# Altium schematic sheet Source_TIA.SchDoc: TIA and damper
size A4; Author: Watzek; DrawnBy: Watzek; Organization: HTL Hollabrunn; Address1: Abteilung Elektronik; Address2: Anton Ehrenfried-Straße 10; Address3: 2020 Hollabrunn; DocumentNumber: 02; Revision: 02; SheetNumber: 02; SheetTotal: 12; SPICEModelCacheBSQSHVBX: <root> / <DocumentId>BSQSHVBX</DocumentId> / <CacheFrame Number="0"> / <Model Name="cap" Kind="MDL"> / <Text>*Default semiconductor capacitor / .MODEL CAP C()</Text> / </Model> / </CacheFrame> / </root>
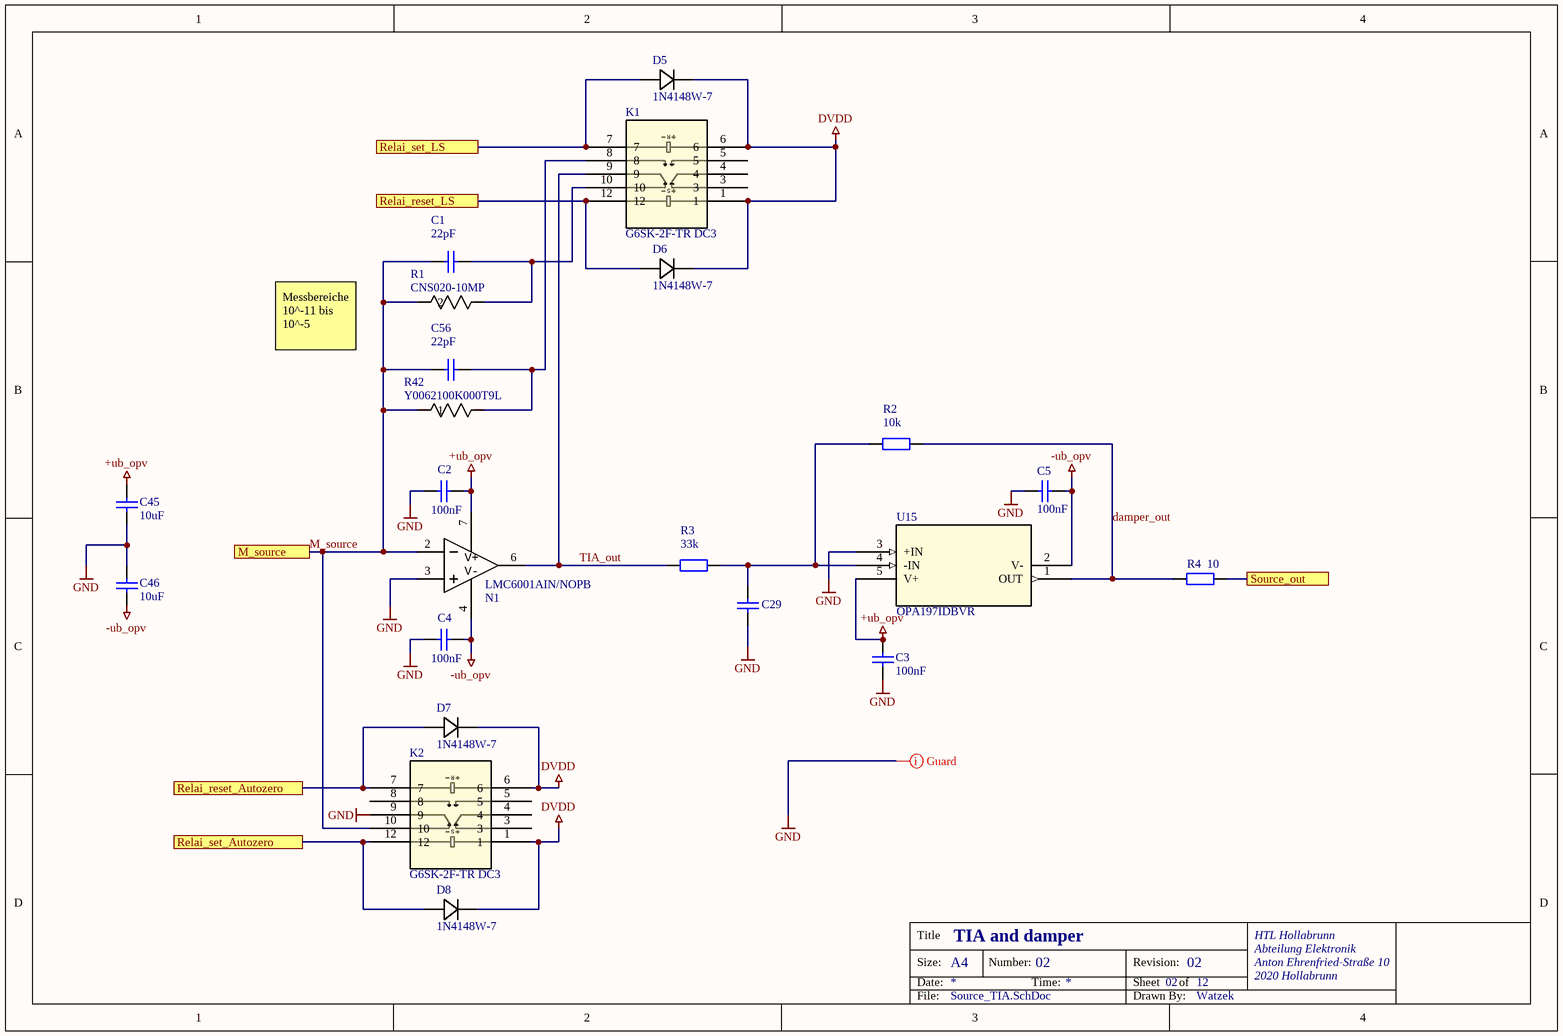
[diagram p0: Source_TIA.SchDoc]

## Parts
C1  22pF  [C1206-KUE]
C2  100nF  [C1206-KUE]
C3  100nF  [C1206-KUE]
C4  100nF  [C1206-KUE]
C5  100nF  [C1206-KUE]
C29  (no value)  [C1206-KUE]
C45  10uF  [C1206-KUE]
C46  10uF  [C1206-KUE]
C56  22pF  [C1206-KUE]
D5  1N4148W-7  [SOD123_DIO]
D6  1N4148W-7  [SOD123_DIO]
D7  1N4148W-7  [SOD123_DIO]
D8  1N4148W-7  [SOD123_DIO]
K1  G6SK-2F-TR DC3  [RELAY_G6SK-2F DC3_OMR]
K2  G6SK-2F-TR DC3  [RELAY_G6SK-2F DC3_OMR]
N1  LMC6001AIN/NOPB  [DIP8]
R1  CNS020-10MP  [RES_CNS020_VIS]
R2  10k  [C1206-KUE]
R3  33k  [C1206-KUE]
R4  10  [C1206-KUE]
R42  Y0062100K000T9L  [RES_S102K_7P62X2P67_VIS]
U15  OPA197IDBVR  [DBV5_TEX]

## Ports
M_source, Relai_reset_Autozero, Relai_reset_LS, Relai_set_Autozero, Relai_set_LS, Source_out

## Nets
+ub_opv: C2.2 C3.2 C45.2 N1.7(V+) U15.5(V+)
-ub_opv: C4.2 C5.2 C46.1 N1.4(V-) U15.2(V-)
DVDD: D5.1 D6.1 D7.1 D8.1 K1.1 K1.6 K2.1 K2.6
GND: C2.1 C3.1 C4.1 C5.1 C29.1 C45.1 C46.2 K2.9 N1.3(IN+) U15.3(+IN)
damper_out: R2.1 R4.2 U15.1(OUT)
M_source: C1.1 C56.1 K2.10 N1.2(IN-) R1.2 R42.1 ; port M_source
Relai_reset_Autozero: D7.2 K2.7 ; port Relai_reset_Autozero
Relai_reset_LS: D6.2 K1.12 ; port Relai_reset_LS
Relai_set_Autozero: D8.2 K2.12 ; port Relai_set_Autozero
Relai_set_LS: D5.2 K1.7 ; port Relai_set_LS
Source_out: R4.1 ; port Source_out
TIA_out: K1.9 N1.6(OUT) R3.2
NetC1_2: C1.2 K1.10 R1.1
NetC29_2: C29.2 R2.2 R3.1 U15.4(-IN)
NetC56_2: C56.2 K1.8 R42.2

Not connected (* = marked no-connect by the designer): K1 3 4 5; K2 3 4 5 8

## Layout directives
mark named Guard: GND

## Notes on the sheet
- Messbereiche 10^-11 bis 10^-5
- Title
- Size:
- Date:
- A4
- Number:
- Time:
- Revision:
- Sheet
- of
- HTL Hollabrunn
- Abteilung Elektronik
- Anton Ehrenfried-Straße 10
- 2020 Hollabrunn
- File:
- Drawn By:
- (in symbol G6SK-2F-TR DC3) R; S

## Library data of the parts
C1-C5 C29 C45 C46 C56 = Capacitor: Manufacturer: Kemet; Bezeichnung: Kerko +-10% 63V; Published: 8-Jun-2000; LatestRevisionDate: 17-Jul-2002; LatestRevisionNote: Re-released for DXP Platform.; PackageReference: RAD-0.3; Publisher: Altium Limited; PackageDescription: Radial Cap, Thru-Hole; 2 Leads; 0.3 in Pin Spacing; Orderingcode: *
  C1 C56: Value: 22pF
  C2-C5: Value: 100nF
  C45 C46: Value: 10uF
D5-D8 = 1N4148W-7: Description; Manufacturer_Name: Diodes Inc; Copyright: Copyright (C) 2026 Ultra Librarian. All rights reserved.; Manufacturer_Part_Number: 1N4148W-7
K1 K2 = G6SK-2F-TR DC3: Description; Manufacturer_Name: Omron; Copyright: Copyright (C) 2026 Ultra Librarian. All rights reserved.; Manufacturer_Part_Number: G6SK-2F-TR DC3; Type: Type; RefDes: RefDes
N1 = LMC6001AINNOPB: Ultra-Low Input Current Amplifier 8-PDIP -40 to 85; Manufacturer_Name: Texas Instruments; Manufacturer: NationalSemiconductor; Characteristics: LMC6001AINUltra-LowInputBiasCurrentOpAmp; CompType: OpAmpIC; TaMin_C: -400; TaMax_C: 850; ComponentLink1DescBC: LMC6001Datasheet; ComponentLink2DescA4: LMC6001WebPage; ComponentLink3DescAC: N08EPackageWebPage; Copyright: Copyright (C) 2025 Ultra Librarian. All rights reserved.; Manufacturer_Part_Number: LMC6001AIN/NOPB; SymbolVersion: 2008-07-09; PartNumber: LMC6001AIN; PackageDescription: 8LeadPlasticDIP; PackageReference: N08E_L; RoHS: O; ComponentLink1URL: http//wwwnationalcom/ds/LM/LMC6001pdf; ComponentLink2URL: http//wwwnationalcom/pf/LM/LMC6001html; ComponentLink3URL: http//wwwnationalcom/packaging/folders/n08ehtml; Version: B1608; LatestRevisionDate: 2009-03-16; LatestRevisionNote: MassUpdate; Publisher: NationalSemiconductor; Published: 2009-03-16
R1 = CNS020-10KP: CNS 020 10K 0,02% e2; Manufacturer_Name: Vishay; Copyright: Copyright (C) 2026 Ultra Librarian. All rights reserved.; Manufacturer_Part_Number: CNS020-10KP; Datasheet: https://www.vishay.com/doc?60051
R2-R4 = ResistorSMD: Resistor SMD; Manufacturer: AVX; Bezeichnung: SMD Wid. 1/8W 2%; Published: 8-Jun-2000; LatestRevisionDate: 17-Jul-2002; LatestRevisionNote: Re-released for DXP Platform.; PackageReference: AXIAL-0.4; Publisher: Altium Limited; PackageDescription: Axial Device, Thru-Hole; 2 Leads; 0.4 in Pin Spacing; Orderingcode: *
  R2: Value: 10k
  R3: Value: 33k
  R4: Value: 10
R42 = Y0062100K000T9L: No Description Available; Manufacturer_Name: Vishay; Copyright: Copyright (C) 2026 Ultra Librarian. All rights reserved.; Manufacturer_Part_Number: Y0062100K000T9L
U15 = OPA197IDBVR: Single, 36-V, precision, rail-to-rail input output, low offset voltage op amp 5-SOT-23 -40 to 125; Manufacturer_Name: Texas Instruments; Copyright: Copyright (C) 2025 Ultra Librarian. All rights reserved.; Manufacturer_Part_Number: OPA197IDBVR; RefDes: RefDes; Type: Type